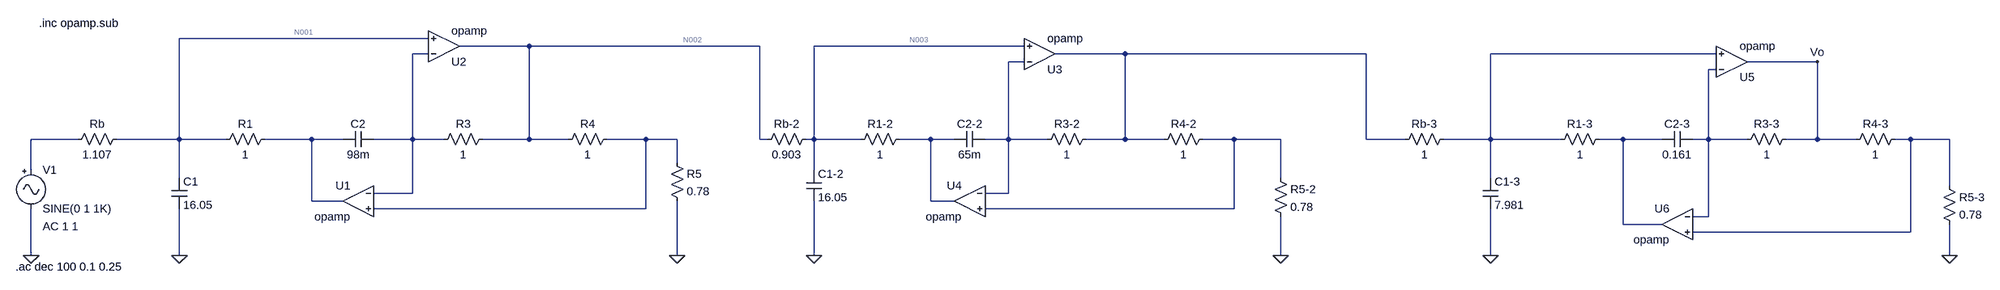
[diagram p0: schematic TS4-Activo2.asc]
TS4-Activo2.asc, the LTspice schematic file:
Version 4
SHEET 1 4468 680
WIRE 944 -144 432 -144
WIRE 1152 -128 1008 -128
WIRE 1824 -128 1152 -128
WIRE 2368 -128 1936 -128
WIRE 944 -112 912 -112
WIRE 2576 -112 2432 -112
WIRE 3120 -112 2576 -112
WIRE 3840 -112 3376 -112
WIRE 2368 -96 2336 -96
WIRE 4048 -96 3904 -96
WIRE 3840 -80 3824 -80
WIRE 128 64 32 64
WIRE 432 64 432 -144
WIRE 432 64 208 64
WIRE 528 64 432 64
WIRE 704 64 608 64
WIRE 768 64 704 64
WIRE 912 64 912 -112
WIRE 912 64 832 64
WIRE 976 64 912 64
WIRE 1152 64 1152 -128
WIRE 1152 64 1056 64
WIRE 1232 64 1152 64
WIRE 1392 64 1312 64
WIRE 1456 64 1392 64
WIRE 1824 64 1824 -128
WIRE 1840 64 1824 64
WIRE 1936 64 1936 -128
WIRE 1936 64 1920 64
WIRE 2032 64 1936 64
WIRE 2176 64 2112 64
WIRE 2224 64 2176 64
WIRE 2336 64 2336 -96
WIRE 2336 64 2288 64
WIRE 2416 64 2336 64
WIRE 2576 64 2576 -112
WIRE 2576 64 2496 64
WIRE 2656 64 2576 64
WIRE 2800 64 2736 64
WIRE 2896 64 2800 64
WIRE 3120 64 3120 -112
WIRE 3200 64 3120 64
WIRE 3376 64 3376 -112
WIRE 3376 64 3280 64
WIRE 3520 64 3376 64
WIRE 3648 64 3600 64
WIRE 3728 64 3648 64
WIRE 3824 64 3824 -80
WIRE 3824 64 3792 64
WIRE 3904 64 3824 64
WIRE 4048 64 4048 -96
WIRE 4048 64 3984 64
WIRE 4128 64 4048 64
WIRE 4240 64 4208 64
WIRE 4320 64 4240 64
WIRE 1456 112 1456 64
WIRE 32 128 32 64
WIRE 1936 128 1936 64
WIRE 432 144 432 64
WIRE 2896 144 2896 64
WIRE 3376 144 3376 64
WIRE 4320 160 4320 64
WIRE 912 176 912 64
WIRE 912 176 832 176
WIRE 2336 176 2336 64
WIRE 2336 176 2288 176
WIRE 704 192 704 64
WIRE 768 192 704 192
WIRE 2176 192 2176 64
WIRE 2224 192 2176 192
WIRE 1392 208 1392 64
WIRE 1392 208 832 208
WIRE 2800 208 2800 64
WIRE 2800 208 2288 208
WIRE 3824 224 3824 64
WIRE 3824 224 3792 224
WIRE 3648 240 3648 64
WIRE 3728 240 3648 240
WIRE 4240 256 4240 64
WIRE 4240 256 3792 256
WIRE 32 304 32 208
WIRE 432 304 432 208
WIRE 1456 304 1456 192
WIRE 1936 304 1936 192
WIRE 2896 304 2896 224
WIRE 3376 304 3376 208
WIRE 4320 304 4320 240
FLAG 32 304 0
FLAG 432 304 0
FLAG 1456 304 0
FLAG 1936 304 0
FLAG 2896 304 0
FLAG 3376 304 0
FLAG 4320 304 0
FLAG 4048 -96 Vo
SYMBOL Misc\\signal 32 112 R0
WINDOW 123 24 132 Left 2
WINDOW 39 0 0 Left 0
SYMATTR Value2 AC 1 1
SYMATTR InstName V1
SYMBOL res 224 48 R90
WINDOW 0 0 56 VBottom 2
WINDOW 3 32 56 VTop 2
SYMATTR InstName Rb
SYMATTR Value 1.107
SYMBOL cap 416 144 R0
SYMATTR InstName C1
SYMATTR Value 16.05
SYMBOL res 624 48 R90
WINDOW 0 0 56 VBottom 2
WINDOW 3 32 56 VTop 2
SYMATTR InstName R1
SYMATTR Value 1
SYMBOL cap 832 48 R90
WINDOW 0 0 32 VBottom 2
WINDOW 3 32 32 VTop 2
SYMATTR InstName C2
SYMATTR Value 98m
SYMBOL OpAmps\\opamp 800 128 M0
SYMATTR InstName U1
SYMBOL res 1072 48 R90
WINDOW 0 0 56 VBottom 2
WINDOW 3 32 56 VTop 2
SYMATTR InstName R3
SYMATTR Value 1
SYMBOL OpAmps\\opamp 976 -64 M180
SYMATTR InstName U2
SYMBOL res 1328 48 R90
WINDOW 0 0 56 VBottom 2
WINDOW 3 32 56 VTop 2
SYMATTR InstName R4
SYMATTR Value 1
SYMBOL res 1440 96 R0
SYMATTR InstName R5
SYMATTR Value 0.78
SYMBOL cap 1920 128 R0
SYMATTR InstName C1-2
SYMATTR Value 16.05
SYMBOL res 2128 48 R90
WINDOW 0 0 56 VBottom 2
WINDOW 3 32 56 VTop 2
SYMATTR InstName R1-2
SYMATTR Value 1
SYMBOL res 1936 48 R90
WINDOW 0 0 56 VBottom 2
WINDOW 3 32 56 VTop 2
SYMATTR InstName Rb-2
SYMATTR Value 0.903
SYMBOL cap 2288 48 R90
WINDOW 0 0 32 VBottom 2
WINDOW 3 32 32 VTop 2
SYMATTR InstName C2-2
SYMATTR Value 65m
SYMBOL res 2512 48 R90
WINDOW 0 0 56 VBottom 2
WINDOW 3 32 56 VTop 2
SYMATTR InstName R3-2
SYMATTR Value 1
SYMBOL res 2752 48 R90
WINDOW 0 0 56 VBottom 2
WINDOW 3 32 56 VTop 2
SYMATTR InstName R4-2
SYMATTR Value 1
SYMBOL res 2880 128 R0
SYMATTR InstName R5-2
SYMATTR Value 0.78
SYMBOL OpAmps\\opamp 2400 -48 M180
SYMATTR InstName U3
SYMBOL OpAmps\\opamp 2256 128 M0
SYMATTR InstName U4
SYMBOL res 3296 48 R90
WINDOW 0 0 56 VBottom 2
WINDOW 3 32 56 VTop 2
SYMATTR InstName Rb-3
SYMATTR Value 1
SYMBOL cap 3360 144 R0
SYMATTR InstName C1-3
SYMATTR Value 7.981
SYMBOL res 3616 48 R90
WINDOW 0 0 56 VBottom 2
WINDOW 3 32 56 VTop 2
SYMATTR InstName R1-3
SYMATTR Value 1
SYMBOL cap 3792 48 R90
WINDOW 0 0 32 VBottom 2
WINDOW 3 32 32 VTop 2
SYMATTR InstName C2-3
SYMATTR Value 0.161
SYMBOL res 4000 48 R90
WINDOW 0 0 56 VBottom 2
WINDOW 3 32 56 VTop 2
SYMATTR InstName R3-3
SYMATTR Value 1
SYMBOL res 4224 48 R90
WINDOW 0 0 56 VBottom 2
WINDOW 3 32 56 VTop 2
SYMATTR InstName R4-3
SYMATTR Value 1
SYMBOL res 4304 144 R0
SYMATTR InstName R5-3
SYMATTR Value 0.78
SYMBOL OpAmps\\opamp 3872 -32 M180
SYMATTR InstName U5
SYMBOL OpAmps\\opamp 3760 176 M0
SYMATTR InstName U6
TEXT 48 -176 Left 2 !.inc opamp.sub
TEXT 0 328 Left 2 !.ac dec 100 0.1 0.25

The netlist it stands for:
* TS4-Activo2.asc
V1 N009 0 SINE(0 1 1K) AC 1 1
Rb N001 N009 1.107
C1 N001 0 16.05
R1 N010 N001 1
C2 N004 N010 98m
XU1 N004 N011 N010 opamp Aol=100K GBW=10Meg  ; pins invin noninvin out
R3 N002 N004 1
XU2 N004 N001 N002 opamp Aol=100K GBW=10Meg  ; pins invin noninvin out
R4 N011 N002 1
R5 N011 0 0.78
C1-2 N003 0 16.05
R1-2 N012 N003 1
Rb-2 N003 N002 0.903
C2-2 N007 N012 65m
R3-2 N005 N007 1
R4-2 N013 N005 1
R5-2 N013 0 0.78
XU3 N007 N003 N005 opamp Aol=100K GBW=10Meg  ; pins invin noninvin out
XU4 N007 N013 N012 opamp Aol=100K GBW=10Meg  ; pins invin noninvin out
Rb-3 N006 N005 1
C1-3 N006 0 7.981
R1-3 N014 N006 1
C2-3 N008 N014 0.161
R3-3 Vo N008 1
R4-3 N015 Vo 1
R5-3 N015 0 0.78
XU5 N008 N006 Vo opamp Aol=100K GBW=10Meg  ; pins invin noninvin out
XU6 N008 N015 N014 opamp Aol=100K GBW=10Meg  ; pins invin noninvin out
.inc opamp.sub
.ac dec 100 0.1 0.25
.backanno
.end

* Results of the author's LTspice run, read from the files saved beside the schematic
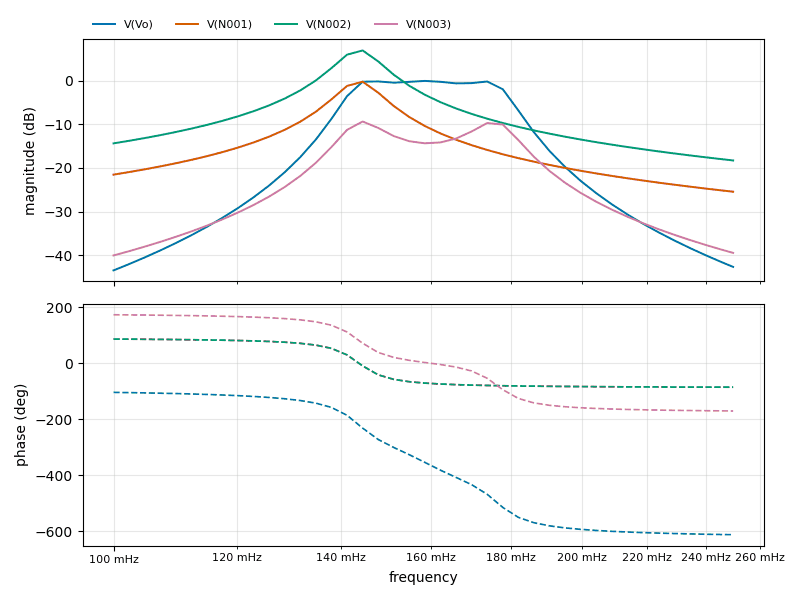
[diagram p1: AC Analysis of TS4-Activo2.asc, plotted from the saved traces]
* AC Analysis, 1 run:
*   V(Vo): -43.49 dB at 100 mHz, -42.68 dB at 250 mHz, peak -0.04 dB at 158.5 mHz, 3 dB below the peak at 141.7 mHz and 178.8 mHz
*   V(N001): -21.53 dB at 100 mHz, -25.44 dB at 250 mHz, peak -0.23 dB at 144.5 mHz, 3 dB below the peak at 139.1 mHz and 148.5 mHz
*   V(N002): -14.36 dB at 100 mHz, -18.28 dB at 250 mHz, peak 6.94 dB at 144.5 mHz, 3 dB below the peak at 139.1 mHz and 148.5 mHz
*   V(N003): -40.06 dB at 100 mHz, -39.47 dB at 250 mHz, peak -9.35 dB at 144.5 mHz, 3 dB below the peak at 140.3 mHz and 150.7 mHz